# EAGLE design 0x69-2 (EAGLE 6.4)
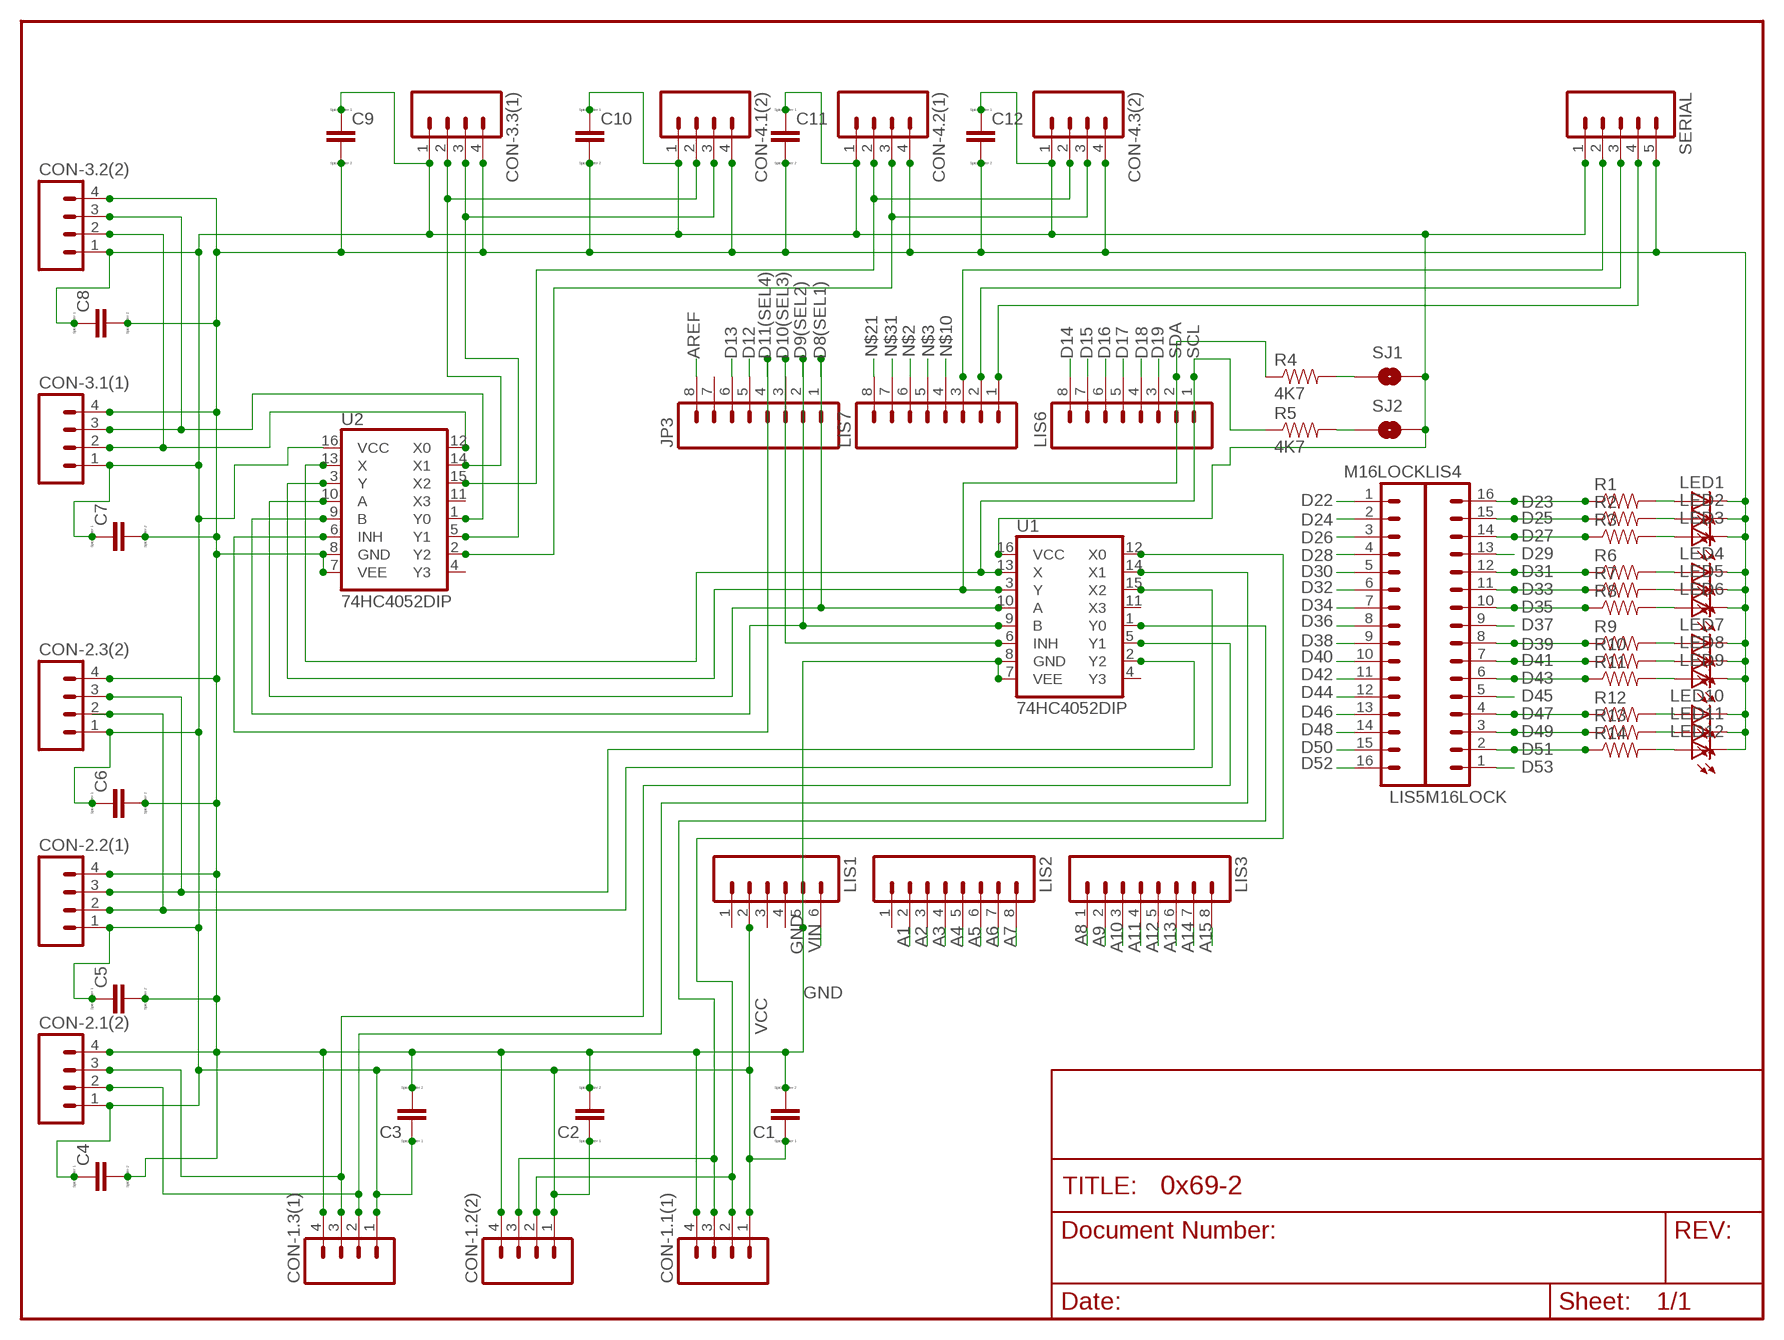
[diagram p0: schematic, sheet 1]

## Parts
C1  C  [C0805]
C2  C  [C0805]
C3  C  [C0805]
C4  C  [C0805]
C5  C  [C0805]
C6  C  [C0805]
C7  C  [C0805]
C8  C  [C0805]
C9  C  [C0805]
C10  C  [C0805]
C11  C  [C0805]
C12  C  [C0805]
CON-1.1(1)  M04LONGPADS  [1X04_LONGPADS]
CON-1.2(2)  M04LONGPADS  [1X04_LONGPADS]
CON-1.3(1)  M04LONGPADS  [1X04_LONGPADS]
CON-2.1(2)  M04LONGPADS  [1X04_LONGPADS]
CON-2.2(1)  M04LONGPADS  [1X04_LONGPADS]
CON-2.3(2)  M04LONGPADS  [1X04_LONGPADS]
CON-3.1(1)  M04LONGPADS  [1X04_LONGPADS]
CON-3.2(2)  M04LONGPADS  [1X04_LONGPADS]
CON-3.3(1)  M04LONGPADS  [1X04_LONGPADS]
CON-4.1(2)  M04LONGPADS  [1X04_LONGPADS]
CON-4.2(1)  M04LONGPADS  [1X04_LONGPADS]
CON-4.3(2)  M04LONGPADS  [1X04_LONGPADS]
JP3  M08LOCK  [1X08_LOCK]
LED1  LED-FKIT-1206  [FKIT-LED-1206]
LED2  LED-FKIT-1206  [FKIT-LED-1206]
LED3  LED-FKIT-1206  [FKIT-LED-1206]
LED4  LED-FKIT-1206  [FKIT-LED-1206]
LED5  LED-FKIT-1206  [FKIT-LED-1206]
LED6  LED-FKIT-1206  [FKIT-LED-1206]
LED7  LED-FKIT-1206  [FKIT-LED-1206]
LED8  LED-FKIT-1206  [FKIT-LED-1206]
LED9  LED-FKIT-1206  [FKIT-LED-1206]
LED10  LED-FKIT-1206  [FKIT-LED-1206]
LED11  LED-FKIT-1206  [FKIT-LED-1206]
LED12  LED-FKIT-1206  [FKIT-LED-1206]
LIS1  M06LOCK  [1X06_LOCK]
LIS2  M08LOCK  [1X08_LOCK]
LIS3  M08LOCK  [1X08_LOCK]
LIS4  M16LOCK  [1X16_LOCK]
LIS5  M16LOCK  [1X16_LOCK]
LIS6  M08LOCK  [1X08_LOCK]
LIS7  M08LOCK  [1X08_LOCK]
R1  0.22OHM1/4W1%(0805)  [0805]
R2  0.22OHM1/4W1%(0805)  [0805]
R3  0.22OHM1/4W1%(0805)  [0805]
R4  4K7  47KOHM1/10W1%(0603)  [0603-RES]
R5  4K7  47KOHM1/10W1%(0603)  [0603-RES]
R6  0.22OHM1/4W1%(0805)  [0805]
R7  0.22OHM1/4W1%(0805)  [0805]
R8  0.22OHM1/4W1%(0805)  [0805]
R9  0.22OHM1/4W1%(0805)  [0805]
R10  0.22OHM1/4W1%(0805)  [0805]
R11  0.22OHM1/4W1%(0805)  [0805]
R12  0.22OHM1/4W1%(0805)  [0805]
R13  0.22OHM1/4W1%(0805)  [0805]
R14  0.22OHM1/4W1%(0805)  [0805]
SERIAL  M05PTH_LONGPADS  [1X05_LONGPADS]
SJ1  SOLDERJUMPERNC  [SJ-NC]
SJ2  SOLDERJUMPERNC  [SJ-NC]
U1  74HC4052DIP  [DIL16]
U2  74HC4052DIP  [DIL16]

## Nets
A1: LIS2.2
A2: LIS2.3
A3: LIS2.4
A4: LIS2.5
A5: LIS2.6
A6: LIS2.7
A7: LIS2.8
A8: LIS3.1
A9: LIS3.2
A10: LIS3.3
A11: LIS3.4
A12: LIS3.5
A13: LIS3.6
A14: LIS3.7
A15: LIS3.8
AREF: JP3.8
D8(SEL1): JP3.1 U1.10(A) U2.10(A)
D9(SEL2): JP3.2 U1.9(B) U2.9(B)
D10(SEL3): JP3.3 U1.6(INH)
D11(SEL4): JP3.4 U2.6(INH)
D12: JP3.5
D13: JP3.6
D14: LIS6.8
D15: LIS6.7
D16: LIS6.6
D17: LIS6.5
D18: LIS6.4
D19: LIS6.3
D22: LIS5.1
D23: LIS4.16 R1.1
D24: LIS5.2
D25: LIS4.15 R2.1
D26: LIS5.3
D27: LIS4.14 R3.1
D28: LIS5.4
D29: LIS4.13
D30: LIS5.5
D31: LIS4.12 R6.1
D32: LIS5.6
D33: LIS4.11 R7.1
D34: LIS5.7
D35: LIS4.10 R8.1
D36: LIS5.8
D37: LIS4.9
D38: LIS5.9
D39: LIS4.8 R9.1
D40: LIS5.10
D41: LIS4.7 R10.1
D42: LIS5.11
D43: LIS4.6 R11.1
D44: LIS5.12
D45: LIS4.5
D46: LIS5.13
D47: LIS4.4 R12.1
D48: LIS5.14
D49: LIS4.3 R13.1
D50: LIS5.15
D51: LIS4.2 R14.1
D52: LIS5.16
D53: LIS4.1
GND: C1.2 C2.2 C3.2 C4.2 C5.2 C6.2 C7.2 C8.2 C9.2 C10.2 C11.2 C12.2 CON-1.1(1).4 CON-1.2(2).4 CON-1.3(1).4 CON-2.1(2).4 CON-2.2(1).4 CON-2.3(2).4 CON-3.1(1).4 CON-3.2(2).4 CON-3.3(1).4 CON-4.1(2).4 CON-4.2(1).4 CON-4.3(2).4 LED1.C LED2.C LED3.C LED4.C LED5.C LED6.C LED7.C LED8.C LED9.C LED10.C LED11.C LED12.C LIS1.5 SERIAL.5 U1.7(VEE) U1.8(GND) U2.7(VEE) U2.8(GND)
MODE: LIS7.3 SERIAL.2
N$1: R4.2 SJ1.1
N$2: LIS7.6
N$3: LIS7.5
N$4: R5.2 SJ2.1
N$5: CON-1.1(1).2 CON-1.2(2).2 U1.12(X0)
N$7: CON-1.1(1).3 CON-1.2(2).3 U1.1(Y0)
N$8: CON-4.2(1).2 CON-4.3(2).2 U2.15(X2)
N$9: CON-1.3(1).2 CON-2.1(2).2 U1.14(X1)
N$10: LIS7.4
N$11: CON-1.3(1).3 CON-2.1(2).3 U1.5(Y1)
N$12: CON-2.2(1).2 CON-2.3(2).2 U1.15(X2)
N$13: LED1.A R1.2
N$14: LED2.A R2.2
N$15: LED3.A R3.2
N$16: CON-2.2(1).3 CON-2.3(2).3 U1.2(Y2)
N$17: CON-4.2(1).3 CON-4.3(2).3 U2.2(Y2)
N$19: CON-3.1(1).3 CON-3.2(2).3 U2.1(Y0)
N$20: CON-3.1(1).2 CON-3.2(2).2 U2.12(X0)
N$21: LIS7.8
N$25: CON-3.3(1).2 CON-4.1(2).2 U2.14(X1)
N$26: CON-3.3(1).3 CON-4.1(2).3 U2.5(Y1)
N$31: LIS7.7
N$34: LED4.A R6.2
N$35: LED5.A R7.2
N$36: LED6.A R8.2
N$37: LED7.A R9.2
N$38: LED8.A R10.2
N$39: LED9.A R11.2
N$40: LED10.A R12.2
N$41: LED11.A R13.2
N$42: LED12.A R14.2
RX0: LIS7.1 SERIAL.4
SCL: LIS6.1 R5.1 U1.13(X) U2.13(X)
SDA: LIS6.2 R4.1 U1.3(Y) U2.3(Y)
TX0: LIS7.2 SERIAL.3
VCC: C1.1 C2.1 C3.1 C4.1 C5.1 C6.1 C7.1 C8.1 C9.1 C10.1 C11.1 C12.1 CON-1.1(1).1 CON-1.2(2).1 CON-1.3(1).1 CON-2.1(2).1 CON-2.2(1).1 CON-2.3(2).1 CON-3.1(1).1 CON-3.2(2).1 CON-3.3(1).1 CON-4.1(2).1 CON-4.2(1).1 CON-4.3(2).1 LIS1.2 SERIAL.1 SJ1.2 SJ2.2 U1.16(VCC) U2.16(VCC)
VIN: LIS1.6
Unconnected: JP3.7 LIS1.1 LIS1.3 LIS1.4 LIS2.1 U1.4(Y3) U1.11(X3) U2.4(Y3) U2.11(X3)

## Library data of the parts
C1-C12 = eagle-ltspice:C: CAPACITOR, European symbol; SPICEMODEL: NONE; SPICEPREFIX: C
CON-1.1(1) CON-1.2(2) CON-1.3(1) CON-2.1(2) CON-2.2(1) CON-2.3(2) CON-3.1(1) CON-3.2(2) CON-3.3(1) CON-4.1(2) CON-4.2(1) CON-4.3(2) = SparkFun-Connectors:M04: Header 4 Standard 4-pin 0.1" header. Use with straight break away headers (SKU : PRT-00116), right angle break away headers (PRT-00553), swiss pins (PRT-00743), machine pins (PRT-00117), and female headers (PRT-00115). Molex polarized connector foot print use with SKU : PRT-08231 with associated crimp pins and housings. 1MM SMD Version SKU: PRT-10208
JP3 LIS2 LIS3 LIS6 LIS7 = SparkFun:M08: Header 8 Standard 8-pin 0.1" header. Use with straight break away headers (SKU : PRT-00116), right angle break away headers (PRT-00553), swiss pins (PRT-00743), machine pins (PRT-00117), and female headers (PRT-00115).
LED1-LED12 = SparkFun-LED:LED: LEDs Standard schematic elements and footprints for 5mm, 3mm, 1206, and 0603 sized LEDs. 5mm - Spark Fun Electronics SKU : COM-00529 (and others)
LIS1 = SparkFun:M06: Header 6 Standard 6-pin 0.1" header. Use with straight break away headers (SKU : PRT-00116), right angle break away headers (PRT-00553), swiss pins (PRT-00743), machine pins (PRT-00117), and female headers (PRT-00115). Molex polarized connector foot print use with SKU : PRT-08094 with associated crimp pins and housings. NOTES ON THE VARIANTS LOCK and LOCK_LONGPADS... This footprint was designed to help hold the alignment of a through-hole component (i.e. 6-pin header) while soldering it into place. You may notice that each hole has been shifted either up or down by 0.005 of an inch from it's more standard position (which is a perfectly straight line). This slight alteration caused the pins (the squares in the middle) to touch the edges of the holes. Because they are alternating, it causes a "brace" to hold the component in place. 0.005 has proven to be the perfect amount of "off-center" position when using our standard breakaway headers. Although looks a little odd when you look at the bare footprint, once you have a header in there, the alteration is very hard to notice. Also, if you push a header all the way into place, it is covered up entirely on the bottom side. This idea of altering the position of holes to aid alignment will be further integrated into the Sparkfun Library for other footprints. It can help hold any component with 3 or more connection pins.
LIS4 LIS5 = SparkFun:M16
R1-R3 R6-R14 = SparkFun-Resistors:0.22OHM1/4W1%(0805): RES-09883; PROD_ID: RES-09883; VALUE: 0.22
R4 R5 = SparkFun-Resistors:47KOHM1/10W1%(0603): RES-07871; PROD_ID: RES-07871; VALUE: 47K
SERIAL = SparkFun-Connectors:M05: Header 5 Standard 5-pin 0.1" header. Use with straight break away headers (SKU : PRT-00116), right angle break away headers (PRT-00553), swiss pins (PRT-00743), machine pins (PRT-00117), and female headers (PRT-00115). Molex polarized connector foot print use with SKU : PRT-08230 with associated crimp pins and housings.
SJ1 SJ2 = SparkFun:SOLDERJUMPER: Solder Jumper Standard SMD solder jumper. Used to automate production. Two varients : Normally Open and Normally Closed are the same, but have different paste layers. NC will have a large amount of paste and should jumper during reflow.
U1 U2 = SparkFun-AnalogIC:74HC4052: Dual 4:1 analog mux

## Board
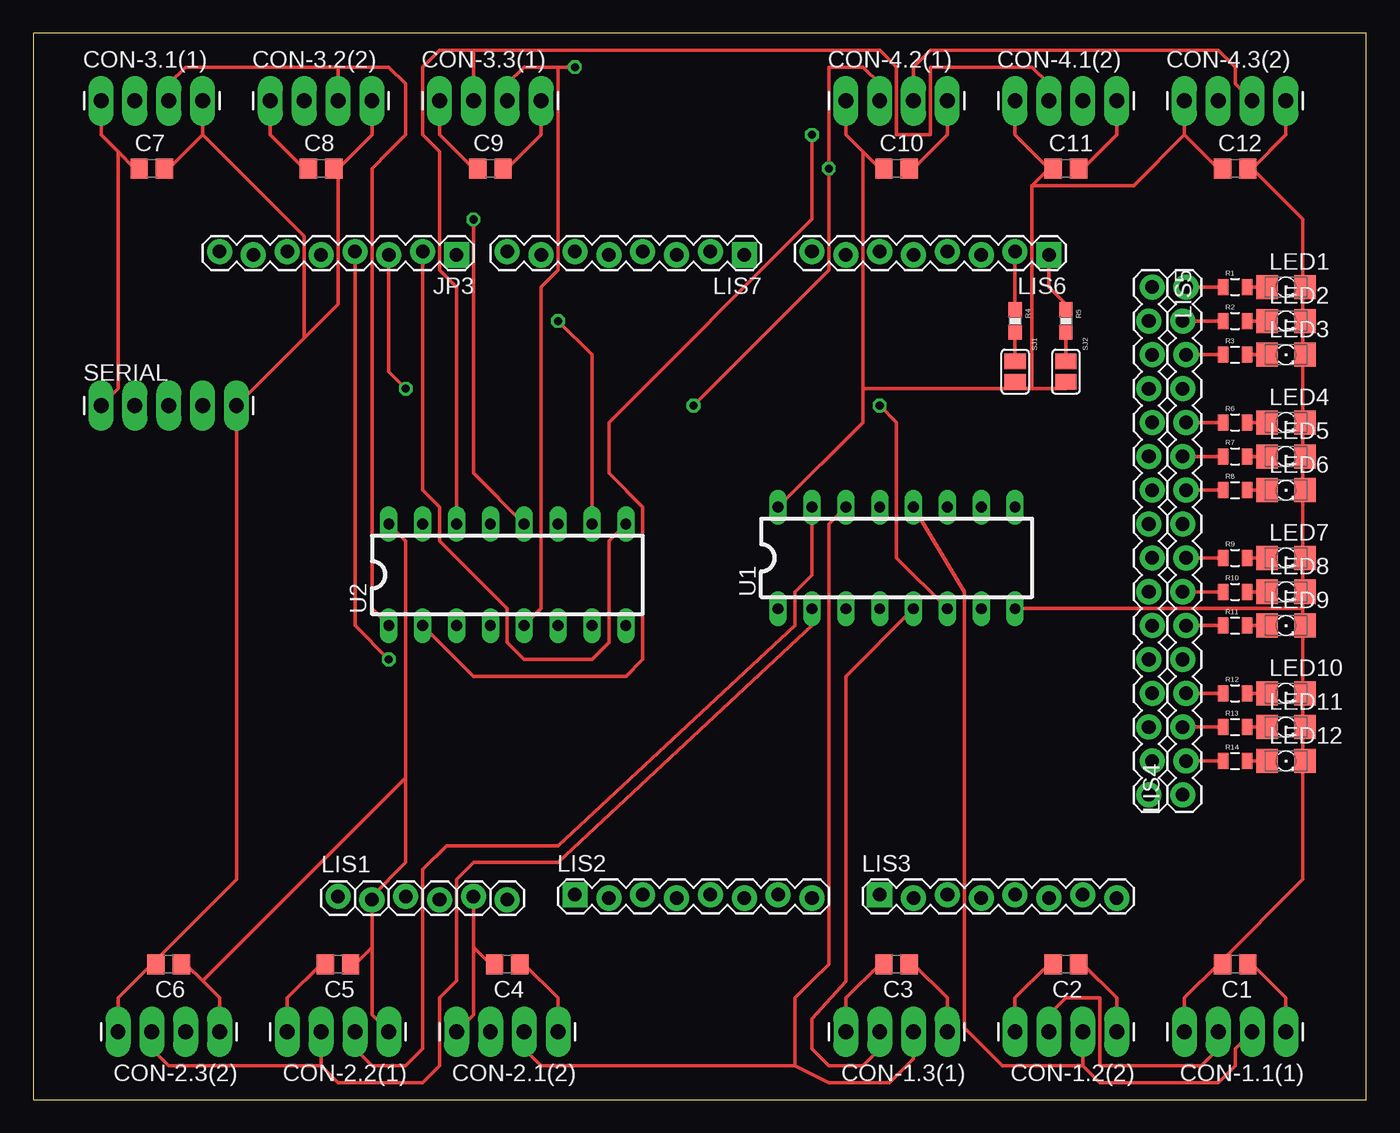
[diagram p1: board, top side]
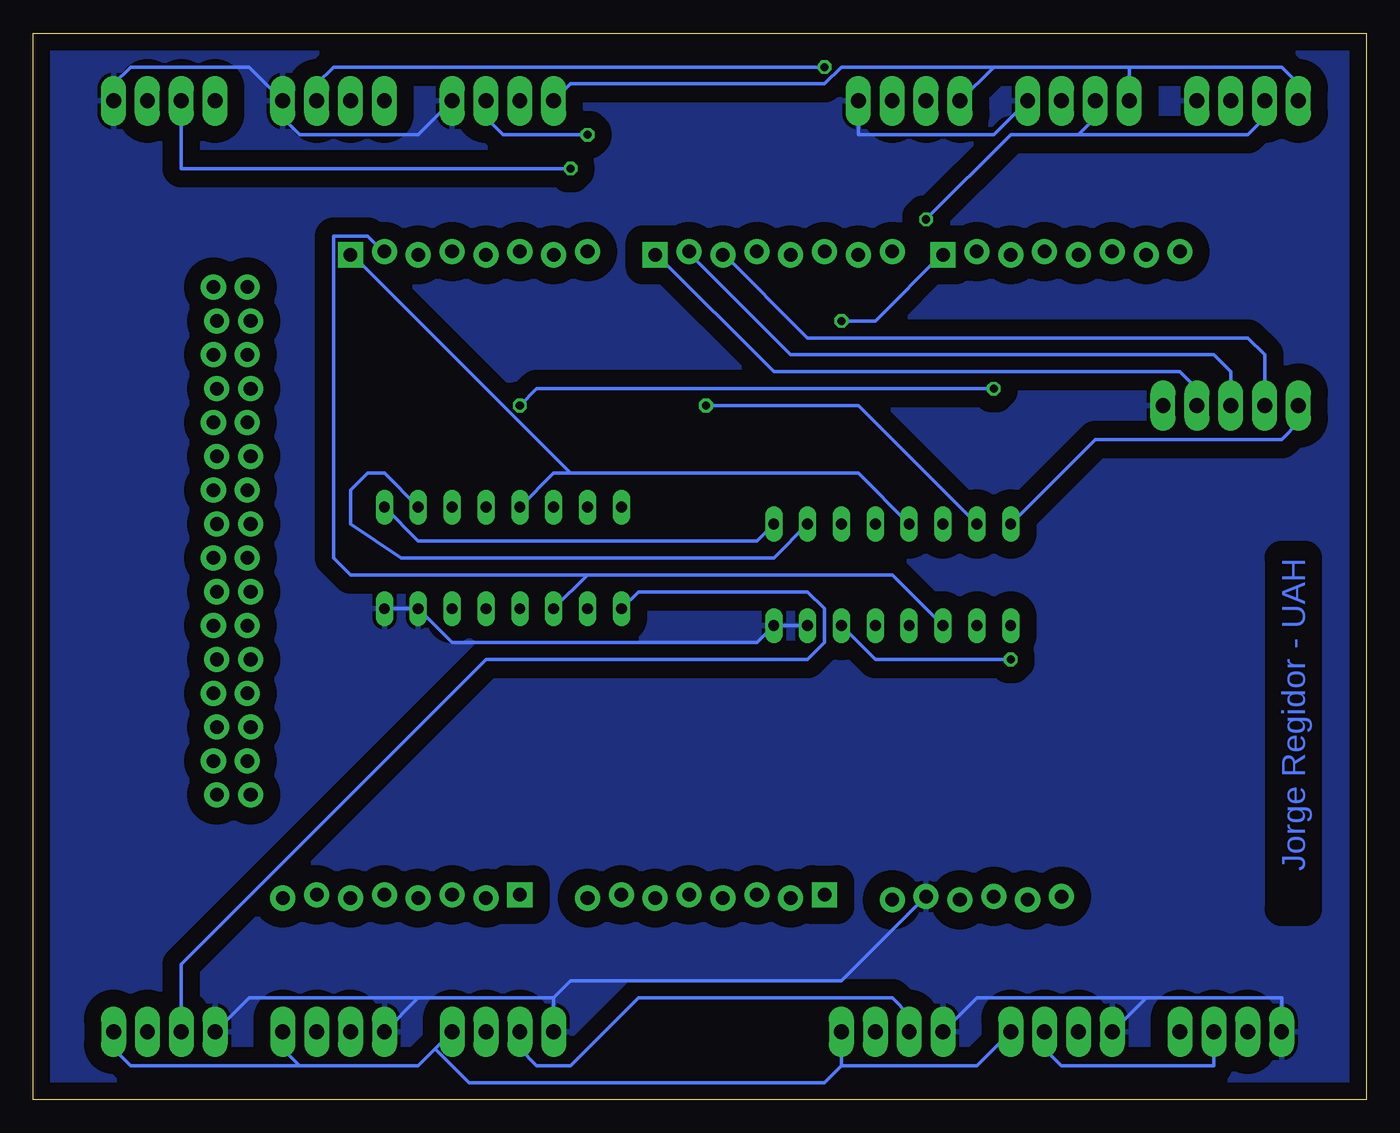
[diagram p2: board, bottom side, seen from below]

Size 100 x 80 mm. Coordinates in mm from the lower left corner, seen from the top.
Outline: 0,0 100,0 100,80 0,80 0,0
Copper layers (1*16): Top 0.035mm / dielectric 1.5mm / Bottom 0.035mm
Design rules "default": minimum track width 10mil, minimum drill 24mil, track to track 8mil, track to pad 8mil, pad to pad 8mil, via to via 8mil, smd to smd 8mil, copper to edge 40mil, drill to drill 8mil, minimum pad ring 10mil, minimum via ring 8mil, stop-mask expansion 4mil, vias tented up to drill 0mil, thermal gap 10mil

### Footprints (pad centres in the part's own frame; a part is rotated, then mirrored left to right if it is on the bottom)
C0805 = smd 1.3 x 1.5: 1 -0.95,0; 2 0.95,0
1X04_LONGPADS = drill 1.118 pad 1.88 long: 1 0,0; 2 2.54,0; 3 5.08,0; 4 7.62,0
1X08_LOCK = drill 1.016 pad 1.88 square: 1 0,0.127 | drill 1.016 pad 1.88: 2 2.54,-0.127; 3 5.08,0.127; 4 7.62,-0.127; 5 10.16,0.127; 6 12.7,-0.127; 7 15.24,0.127; 8 17.78,-0.127
FKIT-LED-1206 = smd 1.6 x 1.803: A -1.422,0; C 1.422,0
1X06_LOCK = drill 1.016 pad 1.88: 1 0,0; 2 2.54,-0.254; 3 5.08,0; 4 7.62,-0.254; 5 10.16,0; 6 12.7,-0.254
1X16_LOCK = drill 1.016 pad 1.88: 1 0,0.127; 2 2.54,-0.127; 3 5.08,0.127; 4 7.62,-0.127; 5 10.16,0.127; 6 12.7,-0.127; 7 15.24,0.127; 8 17.78,-0.127; 9 20.32,0.127; 10 22.86,-0.127; 11 25.4,0.127; 12 27.94,-0.127; 13 30.48,0.127; 14 33.02,-0.127; 15 35.56,0.127; 16 38.1,-0.127
0805 = smd 0.8 x 1.2: 1 -0.9,0; 2 0.9,0
0603-RES = smd 1.1 x 1: 1 -0.85,0; 2 0.85,0
1X05_LONGPADS = drill 1.118 pad 1.88 long: 1 0,0; 2 2.54,0; 3 5.08,0; 4 7.62,0; 5 10.16,0
SJ-NC = smd 1.168 x 1.6: 1 -0.762,0; 2 0.762,0
DIL16 = drill 0.813 long: 1 -8.89,-3.81; 2 -6.35,-3.81; 3 -3.81,-3.81; 4 -1.27,-3.81; 5 1.27,-3.81; 6 3.81,-3.81; 7 6.35,-3.81; 8 8.89,-3.81; 9 8.89,3.81; 10 6.35,3.81; 11 3.81,3.81; 12 1.27,3.81; 13 -1.27,3.81; 14 -3.81,3.81; 15 -6.35,3.81; 16 -8.89,3.81

### Placement (x,y rotation side)
C1  90.17,10.16 180 top
C2  77.47,10.16 180 top
C3  64.77,10.16 180 top
C4  35.56,10.16 180 top
C5  22.86,10.16 180 top
C6  10.16,10.16 180 top
C7  8.89,69.85 0 top
C8  21.59,69.85 0 top
C9  34.29,69.85 0 top
C10  64.77,69.85 0 top
C11  77.47,69.85 0 top
C12  90.17,69.85 0 top
CON-1.1(1)  93.98,5.08 180 top
CON-1.2(2)  81.28,5.08 180 top
CON-1.3(1)  68.58,5.08 180 top
CON-2.1(2)  39.37,5.08 180 top
CON-2.2(1)  26.67,5.08 180 top
CON-2.3(2)  13.97,5.08 180 top
CON-3.1(1)  5.08,74.93 0 top
CON-3.2(2)  17.78,74.93 0 top
CON-3.3(1)  30.48,74.93 0 top
CON-4.1(2)  73.66,74.93 0 top
CON-4.2(1)  60.96,74.93 0 top
CON-4.3(2)  86.36,74.93 0 top
JP3  31.75,63.5 180 top
LED1  93.98,60.96 0 top
LED2  93.98,58.42 0 top
LED3  93.98,55.88 0 top
LED4  93.98,50.8 0 top
LED5  93.98,48.26 0 top
LED6  93.98,45.72 0 top
LED7  93.98,40.64 0 top
LED8  93.98,38.1 0 top
LED9  93.98,35.56 0 top
LED10  93.98,30.48 0 top
LED11  93.98,27.94 0 top
LED12  93.98,25.4 0 top
LIS1  22.86,15.24 0 top
LIS2  40.64,15.24 0 top
LIS3  63.5,15.24 0 top
LIS4  86.36,22.86 90 top
LIS5  83.82,60.96 270 top
LIS6  76.2,63.5 180 top
LIS7  53.34,63.5 180 top
R1  90.17,60.96 0 top
R2  90.17,58.42 0 top
R3  90.17,55.88 0 top
R4  73.66,58.42 270 top
R5  77.47,58.42 270 top
R6  90.17,50.8 0 top
R7  90.17,48.26 0 top
R8  90.17,45.72 0 top
R9  90.17,40.64 0 top
R10  90.17,38.1 0 top
R11  90.17,35.56 0 top
R12  90.17,30.48 0 top
R13  90.17,27.94 0 top
R14  90.17,25.4 0 top
SERIAL  5.08,52.07 0 top
SJ1  73.66,54.61 270 top
SJ2  77.47,54.61 270 top
U1  64.77,40.64 0 top
U2  35.56,39.37 0 top

### Tracks (layer width: path | path; a pad name or v marks a point on that pad's centre or on a via)
D8(SEL1)  (via drill 0.61)
  Top 0.254: v39.37,58.42 41.91,55.88 U2.10
  Bottom 0.254: U2.10 44.45,40.64 72.39,40.64 76.2,43.18 76.2,45.72 74.93,46.99 73.66,46.99 U1.10 | v39.37,58.42 36.83,58.42 31.75,63.5 JP3.1
D9(SEL2)
  Top 0.254: JP3.2 29.21,45.72 30.48,44.45 30.48,41.91 35.56,36.83 35.56,34.29 36.83,33.02 41.91,33.02 43.18,34.29 43.18,41.91 U2.9
  Bottom 0.254: U2.9 45.72,41.91 71.12,41.91 U1.9
D10(SEL3)  (via drill 0.61)
  Top 0.254: U1.6 64.77,40.64 64.77,50.8 v63.5,52.07 | v27.94,53.34 26.67,54.61 JP3.3 26.67,63.5
  Bottom 0.254: v63.5,52.07 62.23,53.34 v27.94,53.34
D11(SEL4)  (via drill 0.61)
  Top 0.254: v26.67,33.02 24.13,35.56 JP3.4
  Bottom 0.254: U2.6 36.83,33.02 v26.67,33.02
D23
  Top 0.254: R1.1 LIS4.16 86.36,60.96
D25
  Top 0.254: LIS4.15 R2.1
D27
  Top 0.254: R3.1 LIS4.14 86.36,55.88
D31
  Top 0.254: R6.1 LIS4.12 86.36,50.8
D33
  Top 0.254: LIS4.11 R7.1
D35
  Top 0.254: R8.1 LIS4.10 86.36,45.72
D39
  Top 0.254: R9.1 LIS4.8 86.36,40.64
D41
  Top 0.254: LIS4.7 R10.1
D43
  Top 0.254: R11.1 LIS4.6 86.36,35.56
D47
  Top 0.254: R12.1 LIS4.4 86.36,30.48
D49
  Top 0.254: LIS4.3 R13.1
D51
  Top 0.254: R14.1 LIS4.2 86.36,25.4
GND
  Top 0.254: 33.02,11.43 34.29,10.16 C4.2 | LIS1.5 33.02,11.43 | CON-2.1(2).4 33.02,6.35 33.02,11.43 | 8.89,10.16 6.35,7.62 CON-2.3(2).4 | CON-2.2(1).4 19.05,7.62 21.59,10.16 C5.2 | CON-3.3(1).4 38.1,72.39 35.56,69.85 C9.2 | 12.7,72.39 10.16,69.85 C7.2 | CON-3.1(1).4 12.7,72.39 | 22.86,69.85 25.4,72.39 CON-3.2(2).4 | 20.32,57.15 22.86,59.69 22.86,69.85 | 20.32,57.15 SERIAL.5 15.24,16.51 8.89,10.16 | 22.86,69.85 C8.2 | 12.7,72.39 20.32,64.77 20.32,57.15 | 8.89,10.16 C6.2 | 88.9,10.16 86.36,7.62 CON-1.1(1).4 | CON-1.3(1).4 60.96,7.62 63.5,10.16 C3.2 | CON-1.2(2).4 73.66,7.62 76.2,10.16 C2.2 | CON-4.2(1).4 68.58,72.39 66.04,69.85 C10.2 | CON-4.1(2).4 81.28,72.39 78.74,69.85 C11.2 | 95.25,27.94 95.25,25.4 | 95.25,27.94 95.25,30.48 | 95.25,27.94 LED11.C | 95.25,38.1 95.25,36.83 | 95.25,36.83 95.25,35.56 | 95.25,38.1 95.25,40.64 | 95.25,38.1 LED8.C | 95.25,35.56 95.25,30.48 | 95.25,30.48 LED10.C | 95.25,35.56 LED9.C | 91.44,69.85 93.98,72.39 CON-4.3(2).4 | 95.25,48.26 95.25,45.72 | 95.25,48.26 95.25,50.8 | 95.25,48.26 LED5.C | 95.25,58.42 95.25,55.88 | 95.25,58.42 95.25,60.96 | 95.25,58.42 LED2.C | 95.25,55.88 95.25,50.8 | 95.25,50.8 LED4.C | 95.25,55.88 LED3.C | 91.44,69.85 95.25,66.04 95.25,60.96 | 91.44,69.85 C12.2 | 95.25,60.96 LED1.C | 95.25,45.72 95.25,40.64 | 95.25,40.64 LED7.C | 95.25,45.72 LED6.C | 95.25,36.83 U1.8 | 88.9,10.16 95.25,16.51 95.25,25.4 | 88.9,10.16 C1.2 | 95.25,25.4 LED12.C
  Bottom 0.254: CON-2.3(2).4 6.35,7.62 16.51,7.62 | CON-2.2(1).4 16.51,7.62 | CON-2.1(2).4 29.21,7.62 16.51,7.62 | CON-3.3(1).4 38.1,72.39 27.94,72.39 CON-3.2(2).4 | 60.96,7.62 CON-1.3(1).4 | 71.12,7.62 60.96,7.62 | CON-1.2(2).4 71.12,7.62 | CON-1.1(1).4 83.82,7.62 71.12,7.62 | U2.7 U2.8 45.72,34.29 68.58,34.29 U1.7 U1.8 | CON-4.2(1).4 71.12,72.39 80.01,72.39 81.28,73.66 CON-4.1(2).4 83.82,77.47 92.71,77.47 93.98,76.2 CON-4.3(2).4 | LIS1.5 39.37,8.89 59.69,8.89 60.96,7.62
  pour Bottom (isolate 1.27): 0,80.01 100.33,80.01 100.33,0 0,0
MODE
  Bottom 0.254: SERIAL.2 7.62,55.88 8.89,57.15 41.91,57.15 48.26,63.5 LIS7.3
N$1
  Top 0.254: SJ1.1 R4.2
N$4
  Top 0.254: SJ2.1 R5.2
N$5
  Top 0.254: U1.12 69.85,38.1 69.85,5.38 72.69,2.54 78.74,2.54 | CON-1.2(2).2 78.74,2.54 | CON-1.1(1).2 90.17,3.81 90.17,2.54 88.9,1.27 80.01,1.27 78.74,2.54
N$7
  Top 0.254: CON-1.2(2).3 76.2,6.35 77.47,7.62 80.01,7.62 80.01,2.54 87.63,2.54 88.9,3.81 CON-1.1(1).3
  Bottom 0.254: U1.1 54.61,38.1 41.91,38.1 40.64,36.83 40.64,34.29 41.91,33.02 66.04,33.02 88.9,10.16 CON-1.1(1).3
N$8  (via drill 0.61)
  Top 0.254: v49.53,52.07 59.69,62.23 v59.69,69.85 59.69,77.47 62.23,77.47 63.5,76.2 CON-4.2(1).2
  Bottom 0.254: U2.15 38.1,52.07 v49.53,52.07 | CON-4.3(2).2 88.9,69.85 v59.69,69.85
N$9
  Top 0.254: U1.14 59.69,43.18 59.69,10.16 58.42,8.89 57.15,7.62 57.15,2.54 | 57.15,2.54 59.69,1.27 64.24,1.27 66.04,3.07 CON-1.3(1).2 | CON-2.1(2).2 36.83,3.81 38.1,2.54 57.15,2.54
N$11
  Top 0.254: U1.5 60.96,31.75 60.96,8.89 60.95,8.89 58.42,6.06 58.42,3.81 59.69,2.54 62.23,2.54 63.5,3.81 CON-1.3(1).3
  Bottom 0.254: CON-2.1(2).3 34.29,6.35 35.56,7.62 54.61,7.62 59.69,2.54 62.23,2.54 63.5,3.81 CON-1.3(1).3
N$12
  Top 0.254: U1.15 58.42,39.37 57.15,38.1 57.15,35.56 39.37,19.05 31.01,19.05 29.21,17.25 29.21,3.81 27.94,2.54 25.4,2.54 24.13,3.81 CON-2.2(1).2
  Bottom 0.254: CON-2.3(2).2 11.43,2.54 22.86,2.54 24.13,3.81 CON-2.2(1).2
N$13
  Top 0.254: R1.2 LED1.A 92.71,60.96
N$14
  Top 0.254: R2.2 LED2.A 92.71,58.42
N$15
  Top 0.254: R3.2 LED3.A 92.71,55.88
N$16
  Top 0.254: U1.2 58.42,35.56 39.37,17.78 33.02,17.78 31.75,16.51 31.75,8.89 30.48,7.62 30.48,2.54 29.21,1.27 22.86,1.27 21.59,2.54 | CON-2.2(1).3 21.59,2.54 | 21.59,2.54 10.16,2.54 8.89,3.81 CON-2.3(2).3
N$17  (via drill 0.61)
  Top 0.254: U2.2 33.02,31.75 44.45,31.75 45.72,33.02 45.72,44.45 43.18,46.99 43.18,50.8 58.42,66.04 v58.42,72.39 | CON-4.3(2).3 90.17,76.2 90.17,77.47 88.9,78.74 67.31,78.74 66.04,77.47 CON-4.2(1).3
  Bottom 0.254: v58.42,72.39 64.77,72.39 66.04,73.66 CON-4.2(1).3
N$19
  Top 0.254: U2.1 25.4,36.83 25.4,69.85 26.67,71.12 27.94,72.39 27.94,76.2 26.67,77.47 22.86,77.47 | CON-3.2(2).3 22.86,77.47 | CON-3.1(1).3 10.16,76.2 11.43,77.47 22.86,77.47
N$20  (via drill 0.61)
  Top 0.254: U2.12 33.02,46.99 v33.02,66.04
  Bottom 0.254: v33.02,66.04 26.67,72.39 21.59,72.39 | 21.59,72.39 20.32,73.66 CON-3.2(2).2 | 21.59,72.39 8.89,72.39 7.62,73.66 CON-3.1(1).2
N$25
  Top 0.254: U2.14 31.75,60.96 30.48,62.23 30.48,71.12 29.21,72.39 29.21,77.47 30.48,78.74 33.02,78.74 | CON-3.3(1).2 33.02,78.74 | CON-4.1(2).2 76.2,76.2 74.93,77.47 67.31,77.47 67.31,72.39 64.77,72.39 64.77,77.47 63.5,78.74 33.02,78.74
N$26  (via drill 0.61)
  Top 0.254: U2.5 38.1,36.83 38.1,60.96 39.37,62.23 39.37,77.47 | CON-3.3(1).3 35.56,76.2 36.83,77.47 39.37,77.47 | 39.37,77.47 v40.64,77.47
  Bottom 0.254: v40.64,77.47 77.47,77.47 78.74,76.2 CON-4.1(2).3
N$34
  Top 0.254: R6.2 LED4.A 92.71,50.8
N$35
  Top 0.254: R7.2 LED5.A 92.71,48.26
N$36
  Top 0.254: R8.2 LED6.A 92.71,45.72
N$37
  Top 0.254: R9.2 LED7.A 92.71,40.64
N$38
  Top 0.254: R10.2 LED8.A 92.71,38.1
N$39
  Top 0.254: R11.2 LED9.A 92.71,35.56
N$40
  Top 0.254: R12.2 LED10.A 92.71,30.48
N$41
  Top 0.254: R13.2 LED11.A 92.71,27.94
N$42
  Top 0.254: R14.2 LED12.A 92.71,25.4
RX0
  Bottom 0.254: SERIAL.4 12.7,53.34 13.97,54.61 44.45,54.61 53.34,63.5 LIS7.1
SCL
  Top 0.254: R5.1 77.47,59.69 76.2,60.96 LIS6.1 76.2,63.5
  Bottom 0.254: U2.13 38.1,46.99 59.69,46.99 | 59.69,46.99 60.96,46.99 U1.13 | 59.69,46.99 76.2,63.5 LIS6.1
SDA
  Top 0.254: LIS6.2 R4.1
  Bottom 0.254: U2.3 35.56,39.37 58.42,39.37 | U1.3 58.42,39.37 | 58.42,39.37 76.2,39.37 77.47,40.64 77.47,64.77 74.93,64.77 73.66,63.5 LIS6.2
TX0
  Bottom 0.254: SERIAL.3 10.16,54.61 11.43,55.88 43.18,55.88 50.8,63.5 LIS7.2
VCC
  Top 0.254: 86.36,72.39 88.9,69.85 C12.1 | CON-4.3(2).1 86.36,72.39 | 76.2,69.85 73.66,72.39 CON-4.1(2).1 | 74.93,53.34 77.47,53.34 SJ2.2 | 74.93,53.34 73.66,53.34 | 62.23,71.12 60.96,72.39 CON-4.2(1).1 | 62.23,71.12 63.5,69.85 C10.1 | U1.16 62.23,50.8 62.23,53.34 | 62.23,71.12 62.23,53.34 | 62.23,53.34 73.66,53.34 | 73.66,53.34 SJ1.2 | 74.93,68.58 76.2,69.85 | 74.93,53.34 74.93,68.58 | 76.2,69.85 C11.1 | 86.36,72.39 82.55,68.58 74.93,68.58 | CON-3.2(2).1 17.78,72.39 20.32,69.85 C8.1 | CON-3.3(1).1 30.48,72.39 33.02,69.85 C9.1 | 6.35,71.12 5.08,72.39 CON-3.1(1).1 | 6.35,71.12 7.62,69.85 C7.1 | SERIAL.1 6.35,53.34 6.35,71.12 | CON-1.1(1).1 93.98,7.62 91.44,10.16 C1.1 | CON-1.3(1).1 68.58,7.62 66.04,10.16 C3.1 | CON-1.2(2).1 81.28,7.62 78.74,10.16 C2.1 | CON-2.1(2).1 39.37,7.62 36.83,10.16 C4.1 | 12.7,8.89 13.97,7.62 CON-2.3(2).1 | 12.7,8.89 11.43,10.16 C6.1 | 25.4,11.43 24.13,10.16 C5.1 | 25.4,11.43 LIS1.2 25.4,15.24 27.94,17.78 27.94,24.13 | U2.16 27.94,41.91 27.94,24.13 | CON-2.2(1).1 25.4,6.35 25.4,11.43 | 27.94,24.13 12.7,8.89
  Bottom 0.254: 17.78,77.47 CON-3.2(2).1 | 27.94,77.47 17.78,77.47 | CON-3.3(1).1 27.94,77.47 | 17.78,77.47 6.35,77.47 5.08,76.2 CON-3.1(1).1 | 69.85,3.81 71.12,2.54 80.01,2.54 | 69.85,3.81 CON-1.3(1).1 | 80.01,2.54 81.28,3.81 CON-1.2(2).1 | 80.01,2.54 92.71,2.54 93.98,3.81 CON-1.1(1).1 | 39.37,2.54 CON-2.1(2).1 | CON-2.2(1).1 29.21,2.54 39.37,2.54 | 69.85,3.81 67.31,1.27 40.64,1.27 39.37,2.54 | SERIAL.1 5.08,50.8 6.35,49.53 20.32,49.53 U2.16 | CON-4.2(1).1 59.69,76.2 40.64,76.2 39.37,77.47 27.94,77.47

### Text on the board
Bottom: Jorge Regidor - UAH